# EAGLE design SparkFun_GPS_ZED-F9K_pHat (EAGLE 9.5.1)
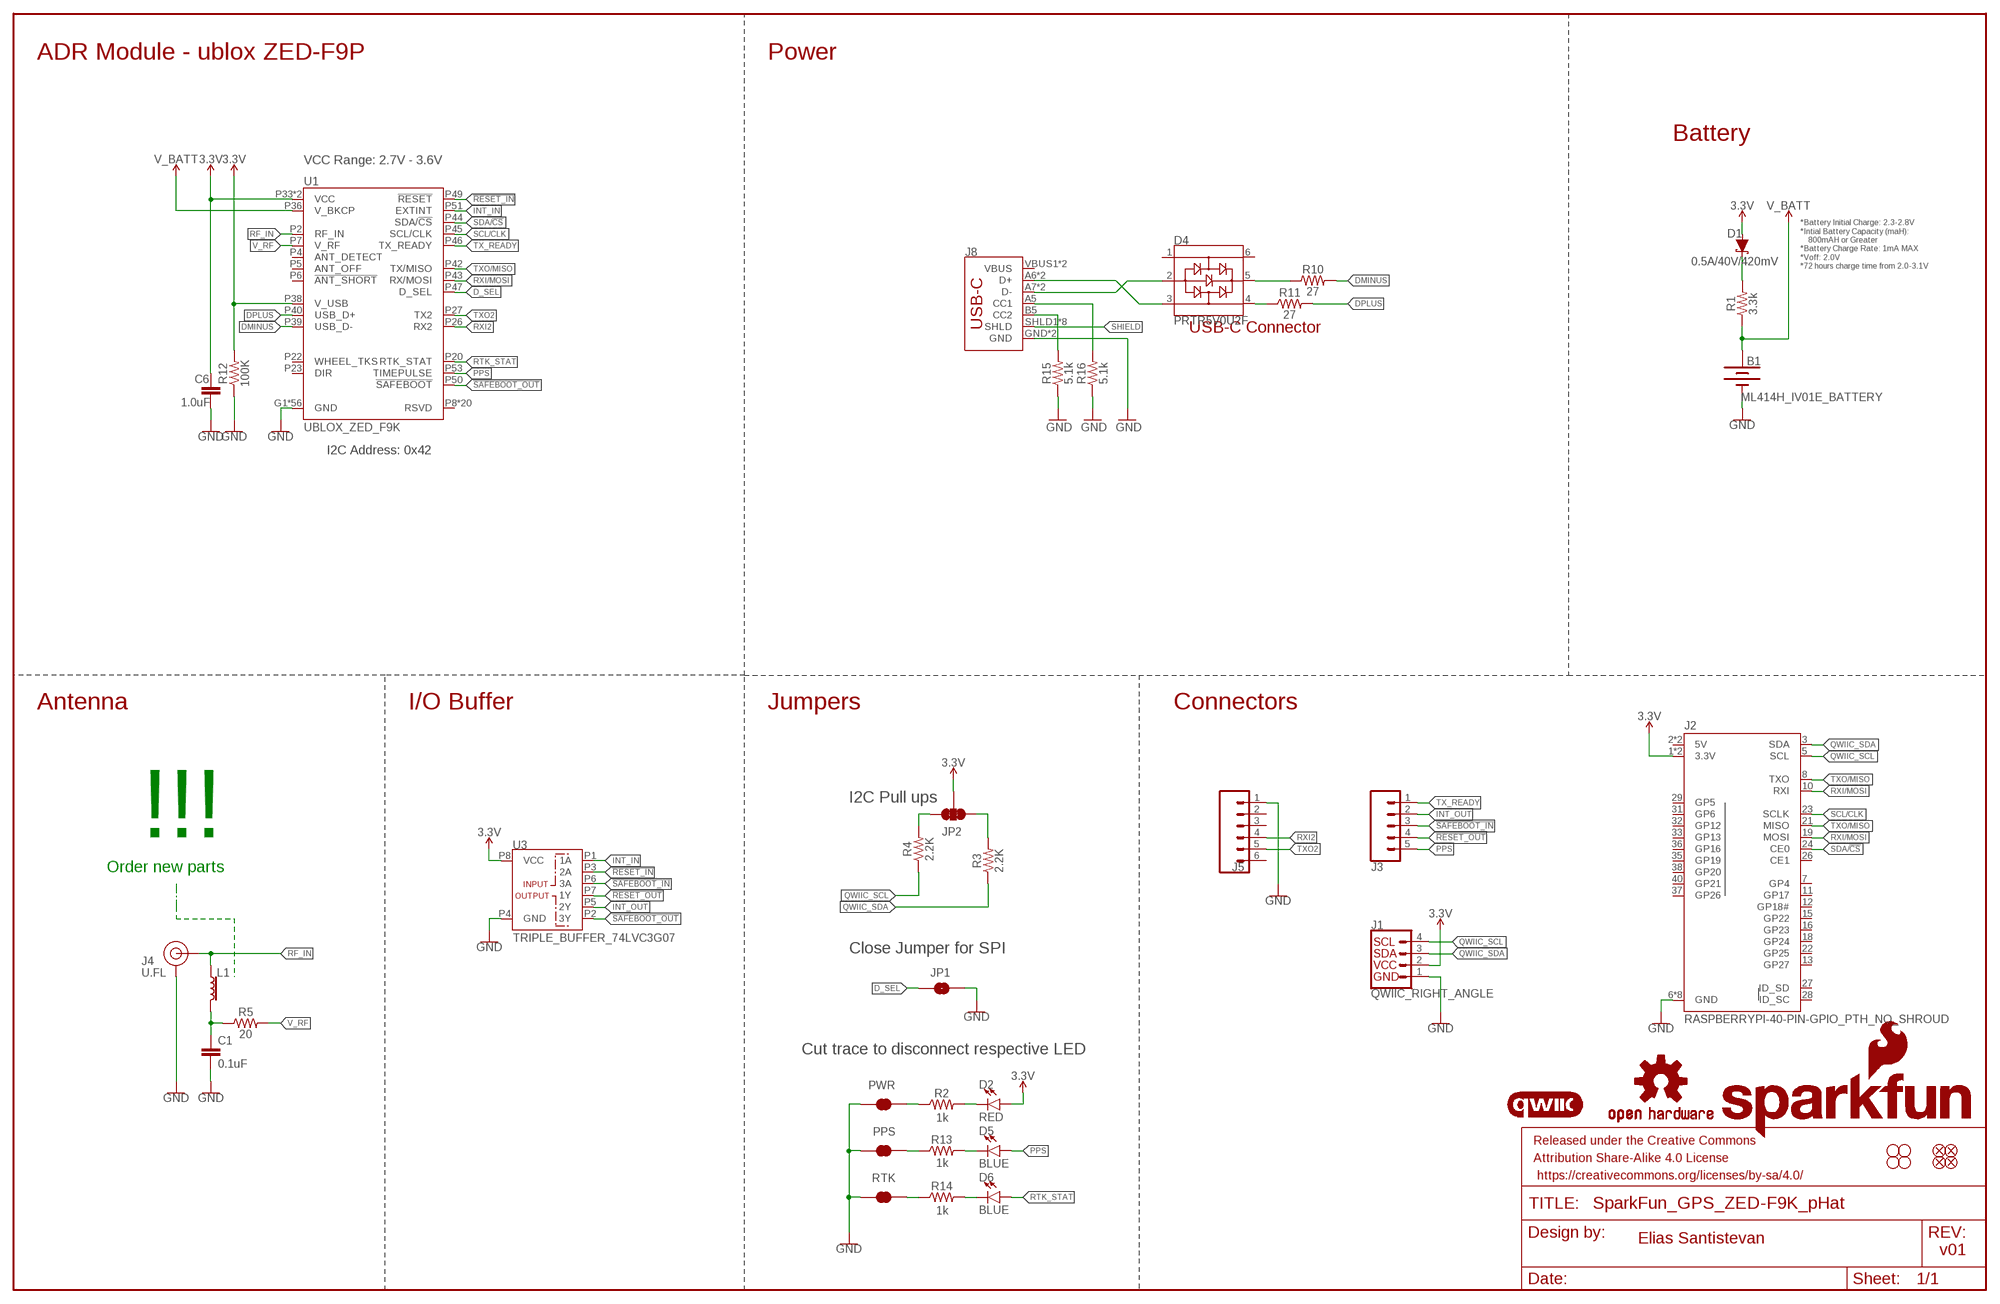
[diagram p0: schematic, sheet 1]

## Parts
B1  ML414H_IV01E_BATTERY  [ML414H_IV01E]
C1  0.1uF  0.1UF-0402-16V-10%  [0402]
C6  1.0uF  1.0UF-0402-16V-10%  [0402]
D1  0.5A/40V/420mV  DIODE-SCHOTTKY-PMEG4005EJ  [SOD-323]
D2  RED  LED-RED0603  [LED-0603]
D4  PRTR5V0U2F  [SOT886]
D5  BLUE  LED-BLUE0603  [LED-0603]
D6  BLUE  LED-BLUE0603  [LED-0603]
FD9  FIDUCIALUFIDUCIAL  [FIDUCIAL-MICRO]
FD10  FIDUCIALUFIDUCIAL  [FIDUCIAL-MICRO]
FD11  FIDUCIALUFIDUCIAL  [FIDUCIAL-MICRO]
FD12  FIDUCIALUFIDUCIAL  [FIDUCIAL-MICRO]
FRAME2  FRAME-LEDGER  [CREATIVE_COMMONS]
H9  STAND-OFFTIGHT  [STAND-OFF-TIGHT]
H10  STAND-OFFTIGHT  [STAND-OFF-TIGHT]
H11  STAND-OFFTIGHT  [STAND-OFF-TIGHT]
H12  STAND-OFFTIGHT  [STAND-OFF-TIGHT]
J1  QWIIC_RIGHT_ANGLE  QWIIC_CONNECTORJS-1MM  [JST04_1MM_RA]
J2  RASPBERRYPI-40-PIN-GPIO_PTH_NO_SHROUD  [2X20]
J3  CONN_05NO_SILK  [1X05_NO_SILK]
J4  U.FL  U.FL2PIN  [U.FL]
J5  CONN_06NO_SILK_NO_POP  [1X06_NO_SILK]
J8  USB_C2-LAYER  [USB-C-16P]
JP1  JUMPER-SMT_2_NO_SILK  [SMT-JUMPER_2_NO_SILK]
JP2  JUMPER-SMT_3_2-NC_TRACE_SILK  [SMT-JUMPER_3_2-NC_TRACE_SILK]
L1  3.9NH  FERRITE_BEAD-120_OHM-0402  [0402]
LOGO1  SFE_LOGO_NAME_FLAME.2_INCH  [SFE_LOGO_NAME_FLAME_.2]
LOGO2  OSHW-LOGOM  [OSHW-LOGO-M]
LOGO3  QWIIC_LOGO_5MM  [QWIIC_5MM]
PPS  JUMPER-SMT_2_NC_TRACE_SILK  [SMT-JUMPER_2_NC_TRACE_SILK]
PWR  JUMPER-SMT_2_NC_TRACE_SILK  [SMT-JUMPER_2_NC_TRACE_SILK]
R1  3.3k  3.3KOHM-0603-1/10W-1%  [0603]
R2  1KOHM-0402-1/16W-1%  [0402]
R3  2.2K  2.2KOHM-0402-1/16W-1%  [0402]
R4  2.2K  2.2KOHM-0402-1/16W-1%  [0402]
R5  20  20OHM-0603-1/10W-1%  [0603]
R10  27  27OHM-0603-1/10W-1%  [0603]
R11  27  27OHM-0603-1/10W-1%  [0603]
R12  100K  100KOHM-0402-1/16W-1%  [0402]
R13  1KOHM-0402-1/16W-1%  [0402]
R14  1KOHM-0402-1/16W-1%  [0402]
R15  5.1k  5.1KOHM-0402-1/16W-1%  [0402]
R16  5.1k  5.1KOHM-0402-1/16W-1%  [0402]
RTK  JUMPER-SMT_2_NC_TRACE_SILK  [SMT-JUMPER_2_NC_TRACE_SILK]
U1  UBLOX_ZED_F9K  [UBLOX_ZED_F9K]
U3  TRIPLE_BUFFER_74LVC3G07  [SOP_8-PIN]

## Nets
3.3V: C6.1 D1.A D2.A J1.2 J2.1(3.3V) J2.17(3.3V) JP2.2 R12.2 U1.P33(VCC) U1.P34(VCC) U1.P38(V_USB) U3.P8(VCC)
!RESET_IN: U1.P49(!RESET!) U3.P3(2A)
!RESET_OUT: J3.4 U3.P7(1Y)
!SAFEBOOT_IN: J3.3 U3.P6(3A)
!SAFEBOOT_OUT: U1.P50(!SAFEBOOT!) U3.P2(3Y)
D_SEL: JP1.1 U1.P47(D_SEL)
DMINUS: R10.2 U1.P39(USB_D-)
DPLUS: R11.2 U1.P40(USB_D+)
GND: B1.- C1.2 C6.2 J1.1 J2.6(GND) J2.9(GND) J2.14(GND) J2.20(GND) J2.25(GND) J2.30(GND) J2.34(GND) J2.39(GND) J4.1(GND) J4.2(GND) J5.1 J8.GND J8.GND2(GND) JP1.2 PPS.1 PWR.1 R12.1 R15.1 R16.1 RTK.1 U1.G1(GND) U1.G2(GND) U1.G3(GND) U1.G4(GND) U1.G5(GND) U1.G6(GND) U1.G7(GND) U1.G8(GND) U1.G9(GND) U1.G10(GND) U1.G11(GND) U1.G12(GND) U1.G13(GND) U1.G14(GND) U1.G15(GND) U1.G16(GND) U1.G17(GND) U1.G18(GND) U1.G19(GND) U1.G20(GND) U1.G21(GND) U1.G22(GND) U1.G23(GND) U1.G24(GND) U1.G25(GND) U1.G26(GND) U1.G27(GND) U1.G28(GND) U1.G29(GND) U1.G30(GND) U1.G31(GND) U1.G32(GND) U1.G33(GND) U1.G34(GND) U1.G35(GND) U1.G36(GND) U1.G37(GND) U1.G38(GND) U1.G39(GND) U1.G40(GND) U1.G41(GND) U1.G42(GND) U1.G43(GND) U1.G44(GND) U1.G45(GND) U1.G46(GND) U1.G47(GND) U1.G48(GND) U1.P1(GND) U1.P3(GND) U1.P12(GND) U1.P14(GND) U1.P32(GND) U1.P37(GND) U1.P41(GND) U1.P48(GND) U3.P4(GND)
INT_IN: U1.P51(EXTINT) U3.P1(1A)
INT_OUT: J3.2 U3.P5(2Y)
N$1: JP2.1 R3.2
N$2: D1.C R1.2
N$3: JP2.3 R4.2
N$4: D2.C R2.2
N$5: C1.1 L1.2 R5.1
N$8: PWR.2 R2.1
N$12: J8.B5(CC2) R15.2
N$16: D4.5 R10.1
N$17: D4.4 R11.1
N$18: J8.A5(CC1) R16.2
N$22: R14.1 RTK.2
N$23: PPS.2 R13.1
N$24: D5.C R13.2
N$25: D6.C R14.2
PPS: D5.A J3.5 U1.P53(TIMEPULSE)
QWIIC_SCL: J1.4 J2.5(SCL) R4.1
QWIIC_SDA: J1.3 J2.3(SDA) R3.1
RF_IN: J4.FEED(SIGNAL) L1.1 U1.P2(RF_IN)
RTK_STAT: D6.A U1.P20(RTK_STAT)
RXI2: J5.4 U1.P26(RX2)
RXI/MOSI: J2.10(RXI) J2.19(MOSI) U1.P43(RX/MOSI)
SCL/CLK: J2.23(SCLK) U1.P45(SCL/CLK)
SDA/!CS: J2.24(CE0) U1.P44(SDA/!CS!)
SHIELD: J8.SHLD1(SHLD) J8.SHLD2(SHLD) J8.SHLD3(SHLD) J8.SHLD4(SHLD) J8.SHLD5(SHLD) J8.SHLD6(SHLD) J8.SHLD7(SHLD) J8.SHLD8(SHLD)
TX_READY: J3.1 U1.P46(TX_READY)
TXO2: J5.5 U1.P27(TX2)
TXO/MISO: J2.8(TXO) J2.21(MISO) U1.P42(TX/MISO)
USB_D+: D4.3 J8.A6(D+) J8.B6(D+)
USB_D-: D4.2 J8.A7(D-) J8.B7(D-)
V_BATT: B1.+ R1.1 U1.P36(V_BKCP)
V_RF: R5.2 U1.P7(V_RF)
Unconnected: D4.1 D4.6 J2.7(GP4) J2.11(GP17) J2.12(GP18#) J2.13(GP27) J2.15(GP22) J2.16(GP23) J2.18(GP24) J2.22(GP25) J2.26(CE1) J2.27(ID_SD) J2.28(ID_SC) J2.29(GP5) J2.31(GP6) J2.32(GP12) J2.33(GP13) J2.35(GP19) J2.36(GP16) J2.37(GP26) J2.38(GP20) J2.40(GP21) J5.2 J5.3 J5.6 J8.VBUS1(VBUS) J8.VBUS2(VBUS) U1.P4(ANT_DETECT) U1.P5(ANT_OFF) U1.P6(!ANT_SHORT!) U1.P8(RSVD) U1.P9(RSVD) U1.P10(RSVD) U1.P11(RSVD) U1.P13(RSVD) U1.P15(RSVD) U1.P16(RSVD) U1.P17(RSVD) U1.P18(RSVD) U1.P19(RSVD) U1.P21(RSVD) U1.P22(WHEEL_TKS) U1.P23(DIR) U1.P24(RSVD) U1.P25(RSVD) U1.P28(RSVD) U1.P29(RSVD) U1.P30(RSVD) U1.P31(RSVD) U1.P35(RSVD) U1.P52(RSVD) U1.P54(RSVD)

## Notes on the sheet
- ADR Module - ublox ZED-F9P | Power
- Battery
- VCC Range: 2.7V - 3.6V
- *Battery Initial Charge: 2.3-2.8V
  *Intial Battery Capacity (maH): 
      800mAH or Greater
  *Battery Charge Rate: 1mA MAX
  *Voff: 2.0V
  *72 hours charge time from 2.0-3.1V
- USB-C Connector
- I2C Address: 0x42
- Antenna | I/O Buffer | Jumpers | Connectors
- I2C Pull ups
- !!!
- Order new parts
- Close Jumper for SPI
- Cut trace to disconnect respective LED
- 1k
- 1k
- 1k
- Elias Santistevan
- v01

## Power pins joined to a net without a drawn wire
5V: J2.2(5V) J2.4(5V)

## Library data of the parts
B1 = SparkFun-Batteries:ML414H_IV01E_BATTERY: SEIKO ML414H-IV01E Reflowable Lithium Battery ML414H is a rechargeable, coin type battery with features such as Pb-free reflowable (Peak temperature: 260 C) and high temperature heat resistance. Battery Characteristics: 3.1V max voltage Voff is 2V 1mAH 3k series resistor with battery 72 hour charge time from 2.0-3.1V 2.3-2.8V initial charge; PROD_ID: BATT-14267
C1 = SparkFun-Capacitors:0.1UF: 0.1µF ceramic capacitors A capacitor is a passive two-terminal electrical component used to store electrical energy temporarily in an electric field.; PROD_ID: CAP-12416
C6 = SparkFun-Capacitors:1.0UF: 1µF ceramic capacitors A capacitor is a passive two-terminal electrical component used to store electrical energy temporarily in an electric field.; PROD_ID: CAP-12417
D1 = SparkFun-DiscreteSemi:DIODE-SCHOTTKY: Schottky diode A Schottky diode is a semiconductor diode which has a low forward voltage drop and a very fast switching action.; PROD_ID: DIO-10955
D2 = SparkFun-LED:LED-RED: Red SMD LED Used in manufacturing of most products at SparkFun Packages: 0603 - SMD 0603 package [Product Link] <http://docs.avagotech.com/docs/AV02-0551EN> 0603 SMART - SMD 0603 SMART package ( more efficient and expensive)[Product Link] <http://www.osram-os.com/Graphics/XPic2/00077099_0.pdf> 1206 - SMD1206 package [Product Link] <https://www.sparkfun.com/datasheets/DevTools/LilyPad/Q150OVS4.pdff> SparkFun Products: Pro Mini 328 -5V <https://www.sparkfun.com/products/821> RedBoard <https://www.sparkfun.com/products/12757> IOIO-OTG <https://www.sparkfun.com/products/13613>; PROD_ID: DIO-00819
D4 = SparkFun-IC-Power:PRTR5V0U2: A small ESD protection device. Most commonly used on USB D+/D- signals to protect large, expensive, or especially sensitive USB enabled devices.; PROD_ID: DIO-14084
D5 D6 = SparkFun-LED:LED-BLUE: Blue SMD LED Used in manufacturing of various products at SparkFun Packages: 0603 - SMD 0603 package [Product Link] <http://www.digikey.com/product-detail/en/SMLE12BC7TT86/511-1589-2-ND/1641808> 1206 - SMD1206 package [Product Link] <http://www.digikey.com/product-detail/en/lite-on-inc/LTST-C150TBKT/160-1643-1-ND/573584> SparkFun Products: ESP8266 Thing-Dev Board <https://www.sparkfun.com/products/13711> RedBoard <https://www.sparkfun.com/products/12757>; PROD_ID: DIO-08575
FD9-FD12 = SparkFun-Aesthetics:FIDUCIAL: Fiducial Alignment Points Point-of-reference for pick-and-place machines and other optical instruments.
FRAME2 = SparkFun-Aesthetics:FRAME-LEDGER: Schematic Frame - Ledger Standard 11x14 US Ledger frame
H9-H12 = SparkFun-Hardware:STAND-OFF: Stand Off Drill holes for mechanically mounting via screws, standoffs, etc. Note: Use the keepout ring to avoid running the screw head into surrounding components. Variant Overviews STAND-OFF - Mechanical footprint for a #4 phillips button head screw. STAND-OFF-TIGHT - Mechanical footprint for a #4 phillips button head screw, Example SparkFun Products Screw - Phillips Head (1/4", 4-40, 10 pack) <https://www.sparkfun.com/products/10453> (PRT-10453) Screw - Phillips Head (1/2", 4-40, 10 pack) <https://www.sparkfun.com/products/10452> (PRT-10452) Screw - Phillips Head (3/4", 4-40, 10 pack) <https://www.sparkfun.com/products/10451> (PRT-10451) Screw - Phillips Head (1", 4-40, 10 pack) <https://www.sparkfun.com/products/10450> (PRT-10450)
J1 = SparkFun-Connectors:QWIIC_CONNECTOR: SparkFun I2C Standard Qwiic Connector An SMD 1mm pitch JST connector makes it easy and quick (get it? Qwiic?) to connect I2C devices to each other. The Qwiic system <http://www.sparkfun.com/qwiic> enables fast and solderless connection between popular platforms and various sensors and actuators. We carry 200mm <https://www.sparkfun.com/products/14204>, 100mm <https://www.sparkfun.com/products/14205>, 50mm <https://www.sparkfun.com/products/14206>, and breadboard friendly <https://www.sparkfun.com/products/14207> Qwiic cables. We also offer 10 pcs strips <https://www.sparkfun.com/products/14323> the SMD connectors.; PROD_ID: CONN-13694
J2 = SparkFun-Connectors:RASPBERRYPI-40-PIN-GPIO: Raspberry Pi GPIO Header 2x20 pin connector, as found on B, B+, A+ models. Both shrouded PTH and SMT versions available. SparkFun Products: GPIO Shrouded Header <https://www.sparkfun.com/products/13054>- PTH SparkFun Pi Wedge (Preassembled) <https://www.sparkfun.com/products/13717>
J3 = SparkFun-Connectors:CONN_05: Multi connection point. Often used as Generic Header-pin footprint for 0.1 inch spaced/style header connections On any of the 0.1 inch spaced packages, you can populate with these: Break Away Headers - Straight <https://www.sparkfun.com/products/116> (PRT-00116) Break Away Male Headers - Right Angle <https://www.sparkfun.com/products/553> (PRT-00553) Female Headers <https://www.sparkfun.com/products/115> (PRT-00115) Break Away Headers - Machine Pin <https://www.sparkfun.com/products/117> (PRT-00117) Break Away Female Headers - Swiss Machine Pin <https://www.sparkfun.com/products/743> (PRT-00743) For SCREWTERMINALS and SPRING TERMINALS visit here: Screw Terimnals on SparkFun.com <https://www.sparkfun.com/search/results?term=Screw+Terminals> (5mm/3.5mm/2.54mm spacing) This device is also useful as a general connection point to wire up your design to another part of your project. Our various solder wires solder well into these plated through hole pads. Hook-Up Wire - Assortment (Stranded, 22 AWG) <https://www.sparkfun.com/products/11375> (PRT-11375) Hook-Up Wire - Assortment (Solid Core, 22 AWG) <https://www.sparkfun.com/products/11367> (PRT-11367) View the entire wire category on our website here <https://www.sparkfun.com/categories/141> Special notes: Molex polarized connector foot print use with SKU : PRT-08231 with associated crimp pins and housings. 1MM SMD Version SKU: PRT-10208
J4 = SparkFun-Connectors:U.FL2PIN: SMD Antenna Connector - U.FL 2mm height, 3.0mm x 3.0mm receptacle size. SparkFun Products: SparkFun WiFi Shield - ESP8266 <https://www.sparkfun.com/products/13287> SparkFun ESP8266 Thing <https://www.sparkfun.com/products/13231> SparkFun MiniGen - Pro Mini Signal Generator Shield <https://www.sparkfun.com/products/11420>; PROD_ID: CONN-09193; SF_ID: WRL-09144
J5 = SparkFun-Connectors:CONN_06: Multi connection point. Often used as Generic Header-pin footprint for 0.1 inch spaced/style header connections On any of the 0.1 inch spaced packages, you can populate with these: Break Away Headers - Straight <https://www.sparkfun.com/products/116> (PRT-00116) Break Away Male Headers - Right Angle <https://www.sparkfun.com/products/553> (PRT-00553) Female Headers <https://www.sparkfun.com/products/115> (PRT-00115) Break Away Headers - Machine Pin <https://www.sparkfun.com/products/117> (PRT-00117) Break Away Female Headers - Swiss Machine Pin <https://www.sparkfun.com/products/743> (PRT-00743) Arduino Stackable Header - 6 Pin <https://www.sparkfun.com/products/9280> (PRT-09280) For SCREWTERMINALS and SPRING TERMINALS visit here: Screw Terimnals on SparkFun.com <https://www.sparkfun.com/search/results?term=Screw+Terminals> (5mm/3.5mm/2.54mm spacing) This device is also useful as a general connection point to wire up your design to another part of your project. Our various solder wires solder well into these plated through hole pads. Hook-Up Wire - Assortment (Stranded, 22 AWG) <https://www.sparkfun.com/products/11375> (PRT-11375) Hook-Up Wire - Assortment (Solid Core, 22 AWG) <https://www.sparkfun.com/products/11367> (PRT-11367) View the entire wire category on our website here <https://www.sparkfun.com/categories/141>
J8 = SparkFun-Connectors:USB_C: USB Type C 16Pin Connector Super Speed pins not available on the 16-pin purely SMD connector so this part is best for USB 2.0 implementations. D1 and D2 are tied together enabling D+/- no matter which way the cable is plugged into the connector. The two channel configuration pins (CC1/2) are exposed. These are normally connected to ground via 5.1k resistors but can be reconfigured for high current/high power applications.; PROD_ID: CONN-14122
JP1 = SparkFun-Jumpers:JUMPER-SMT_2_NO: Normally open jumper This jumper has two pads in close proximity to each other. Apply solder to close the connection. Round pads are easier to solder for beginners, but are a lot larger. SparkFun Product that uses the round pads: SparkFun EL Sequencer <https://www.sparkfun.com/products/12781>
JP2 = SparkFun-Jumpers:JUMPER-SMT_3_2-NC_TRACE: Normally closed trace jumper (2 of 2 connections) This jumper has a trace between all three pads so they are normally closed (NC). Use a razor knife to open the connection(s). For best results follow the IPC guidelines for cutting traces: Cutout at least 0.063 mm (0.005 in). Remove all loose material to clean up the cut area. Seal the cut with an approved epoxy. Reapply solder to reclose the connection(s).
L1 = SparkFun-Coils:FERRITE_BEAD-120_OHM: Ferrite Bead (blocks, cores, rings, chokes, etc.) Inductor with layers of ferrite used to suppress high frequencies. Often used to isolate high frequency noise.; MFG_PART: BLM15HB121SN1D; PROD_ID: NDUC-14206
LOGO1 = SparkFun-Aesthetics:SFE_LOGO_NAME_FLAME: SparkFun Font Logo w/ Flame This is the SparkFun full logo. The logo on the schematic will always be the same size; the package variant is the height of the flame part of the logo. Default layer for the logo on the board is tSilk.
LOGO2 = SparkFun-Aesthetics:OSHW-LOGO: Open-Source Hardware (OSHW) Logo This logo indicates the piece of hardware it is found on incorporates a OSHW license and/or adheres to the definition of open source hardware found here: http://freedomdefined.org/OSHW
LOGO3 = SparkFun-Aesthetics:QWIIC_LOGO: Qwiic Logos for placement on schematic and PCB. The 5.5mm silk logo is best for placing next to Qwiic connector.
PPS PWR RTK = SparkFun-Jumpers:JUMPER-SMT_2_NC_TRACE: Normally closed trace jumper This jumper has a trace between two pads so it's normally closed (NC). Use a razor knife to open the connection. For best results follow the IPC guidelines for cutting traces: Cutout at least 0.063 mm (0.005 in). Remove all loose material to clean up the cut area. Seal the cut with an approved epoxy. Reapply solder to reclose the connection.
R1 = SparkFun-Resistors:3.3KOHM: 3.3kΩ resistor A resistor is a passive two-terminal electrical component that implements electrical resistance as a circuit element. Resistors act to reduce current flow, and, at the same time, act to lower voltage levels within circuits. - Wikipedia; PROD_ID: RES-07851
R2 R13 R14 = SparkFun-Resistors:1KOHM: 1kΩ resistor A resistor is a passive two-terminal electrical component that implements electrical resistance as a circuit element. Resistors act to reduce current flow, and, at the same time, act to lower voltage levels within circuits. - Wikipedia; PROD_ID: RES-14342
R3 R4 = SparkFun-Resistors:2.2KOHM: 2.2kΩ resistor A resistor is a passive two-terminal electrical component that implements electrical resistance as a circuit element. Resistors act to reduce current flow, and, at the same time, act to lower voltage levels within circuits. - Wikipedia; PROD_ID: RES-14341
R5 = SparkFun-Resistors:20OHM: RES-07862; PROD_ID: RES-07862
R10 R11 = SparkFun-Resistors:27OHM: 27Ω resistor A resistor is a passive two-terminal electrical component that implements electrical resistance as a circuit element. Resistors act to reduce current flow, and, at the same time, act to lower voltage levels within circuits. - Wikipedia; PROD_ID: RES-09334
R12 = SparkFun-Resistors:100KOHM: 100kΩ resistor A resistor is a passive two-terminal electrical component that implements electrical resistance as a circuit element. Resistors act to reduce current flow, and, at the same time, act to lower voltage levels within circuits. - Wikipedia; PROD_ID: RES-13495
R15 R16 = SparkFun-Resistors:5.1KOHM; PROD_ID: RES-14340
U1 = classified:UBLOX_ZED_F9K: u-blox ZED-F9K ADR GPS Unit with Real Time Kinematics (RTK) and internal IMU = Automotive Dead Reckoning; PROD_ID: IC-14677
U3 = classified:TRIPLE_BUFFER_74LVC3G07: Triple Buffer with Open Drain Output - 74LVC3G07 The 74LVC3G07 provides three non-inverting buffers. The output of the device is an open-drain and can be connected to other open-drain outputs to implement active-LOW wired-OR or active-HIGH wired-AND functions. Input can be driven from either 3.3 V or 5 V devices. This feature allows the use of this device in a mixed 3.3 V and 5 V environment. Schmitt trigger action at all inputs makes the circuit tolerant for slower input rise and fall time. This device is fully specified for partial power-down applications using IOFF. The IOFF circuitry disables the output, preventing the damaging backflow current through the device when it is powered down

## Net classes
1 Antenna: width 1 mm, clearance 0.3 mm

## Board
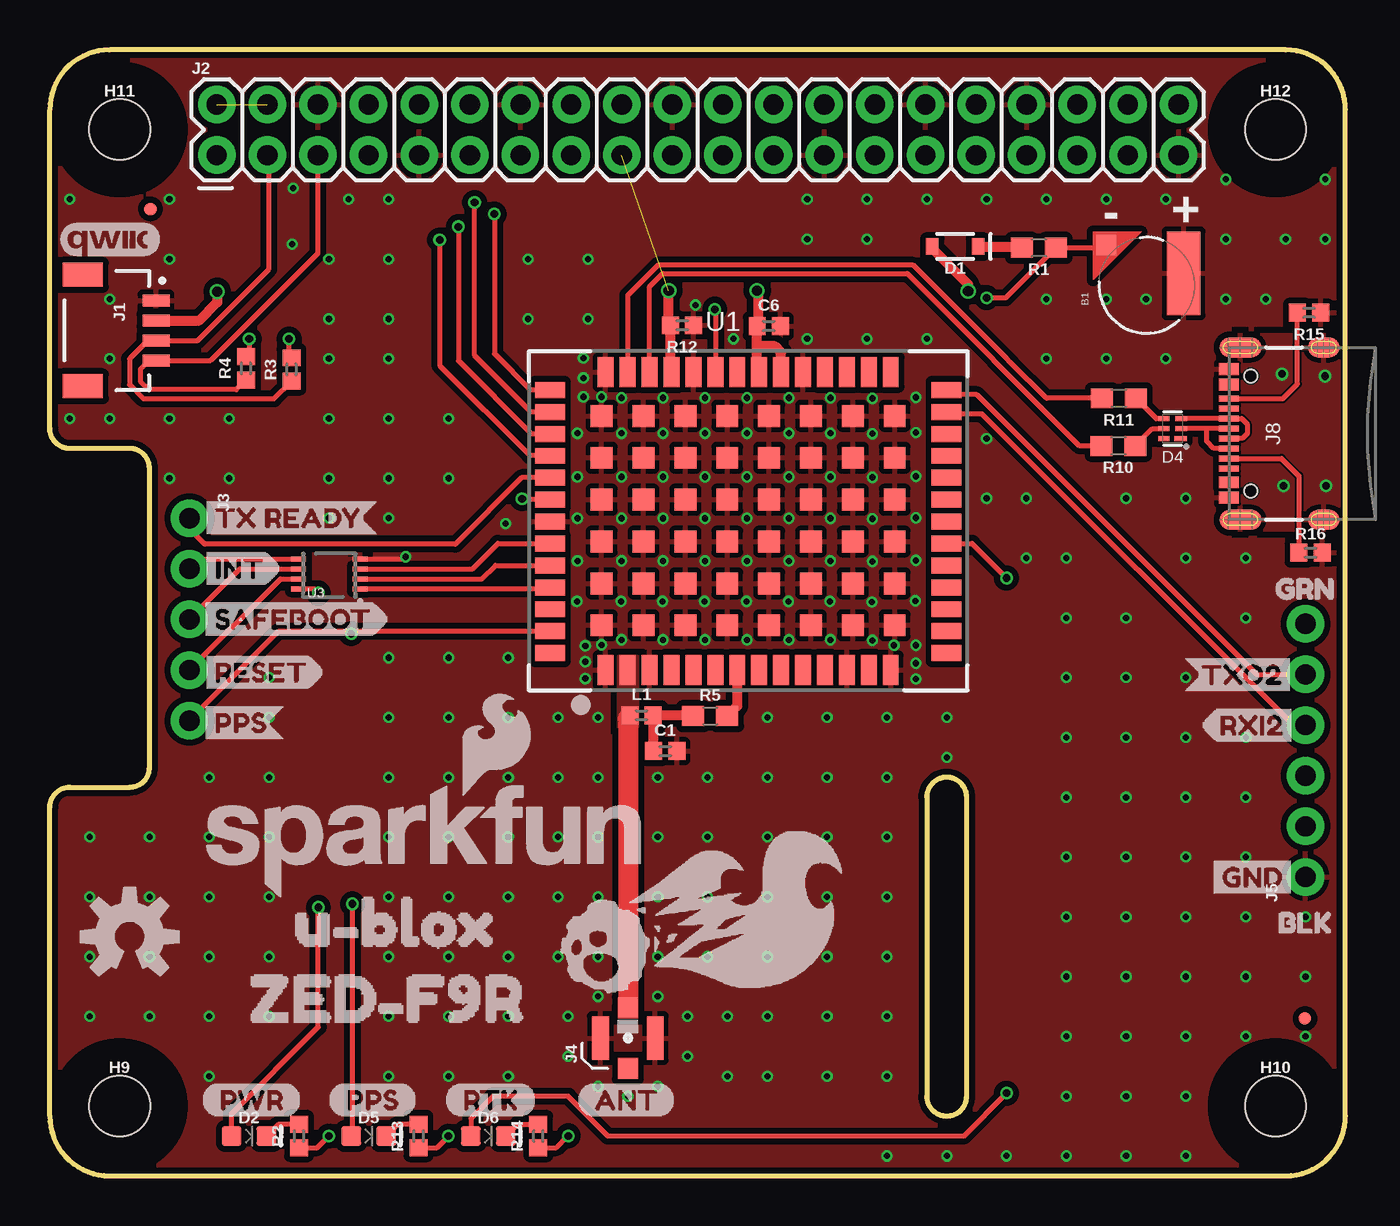
[diagram p1: board, top side]
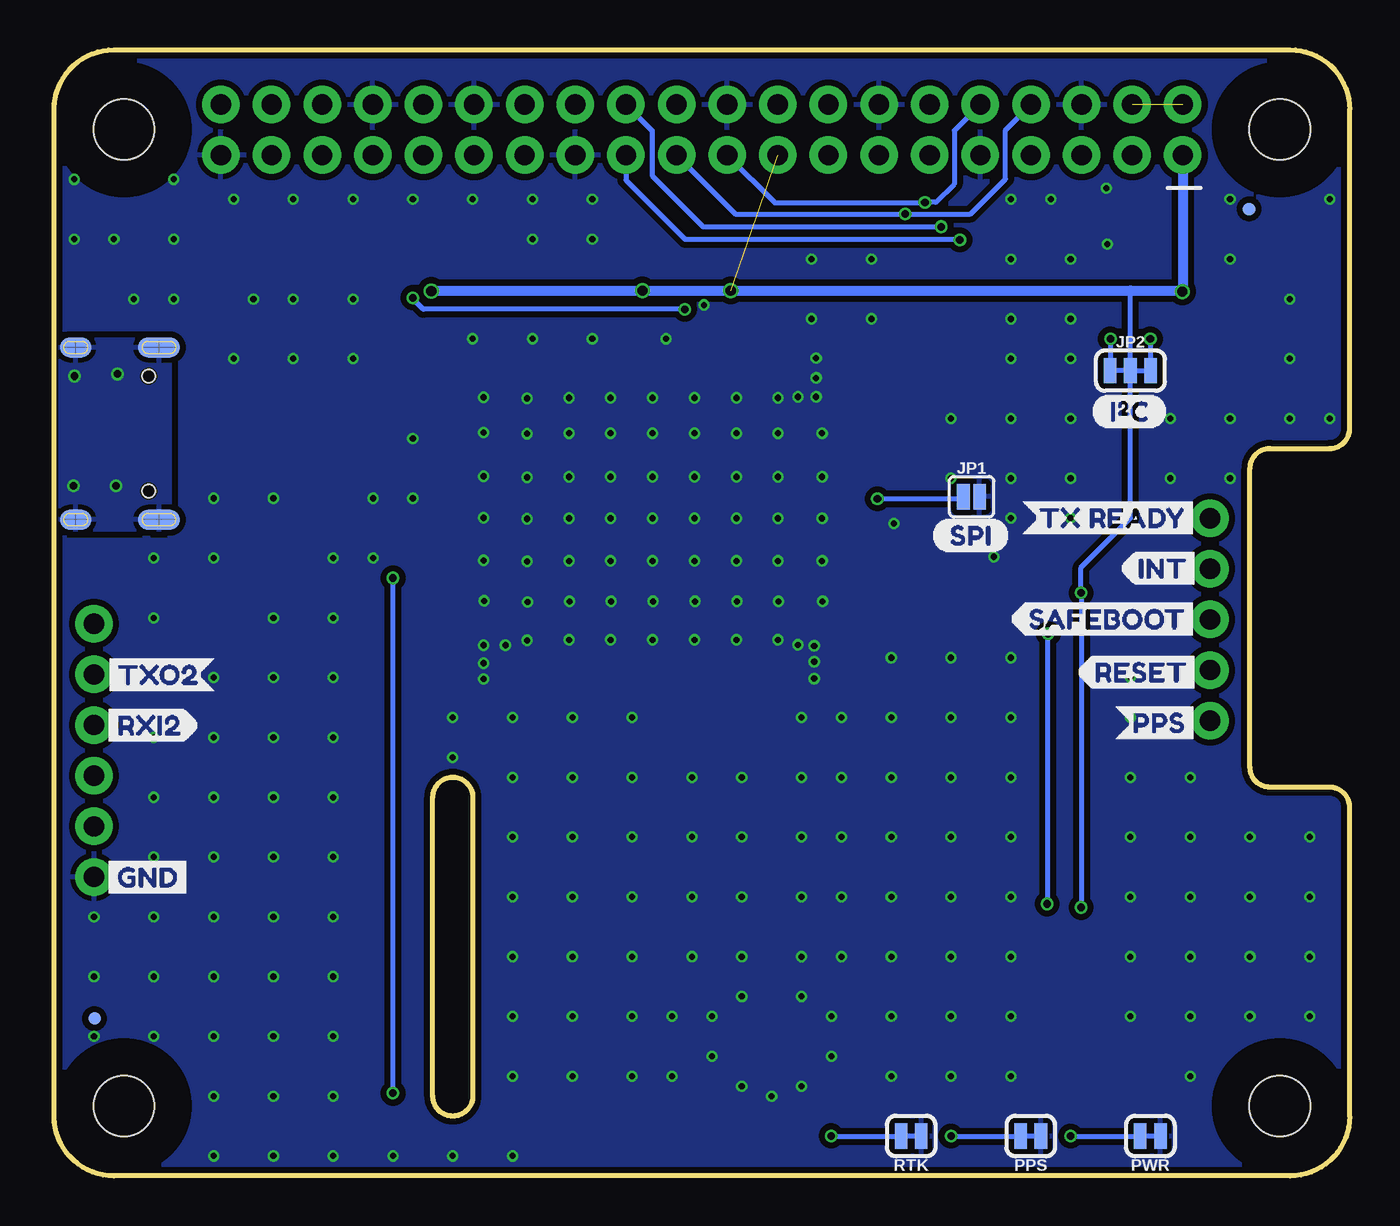
[diagram p2: board, bottom side, seen from below]

Size 65 x 56.5 mm. Coordinates in mm from the lower left corner, seen from the top.
Outline: 3,0 62,0 arc90 65,3 65,53.5 arc90 62,56.5 3,56.5 arc90 0,53.5 0,37.5 arc90 1,36.5 4,36.5 arc-90 5,35.5 5,20.5 arc-90 4,19.5 1,19.5 arc90 0,18.5 0,3 arc90 3,0
Outline: 45,3 arc90 46,4 46,19 arc90 45,20 arc90 44,19 44,4 arc90 45,3
Copper layers (1*16): Top 0.035mm / dielectric 1.5mm / Bottom 0.035mm
Design rules "SparkFun-2-layer-FAB-LIMIT": minimum track width 4mil, minimum drill 6mil, track to track 4mil, track to pad 4mil, pad to pad 4mil, via to via 4mil, smd to smd 4mil, copper to edge 4mil, drill to drill 4mil, minimum pad ring 5mil, minimum via ring 5mil, stop-mask expansion 4mil, vias tented up to drill 25mil, thermal gap 10mil
tRestrict: area 58.4,0.4 to 64.6,6.6; area 0.4,0.4 to 6.6,6.6; area 0.4,49.4 to 6.6,55.6; area 58.4,49.4 to 64.6,55.6
bRestrict: area 0.4,0.4 to 6.6,6.6; area 0.4,49.4 to 6.6,55.6; area 58.4,0.4 to 64.6,6.6; area 58.4,49.4 to 64.6,55.6

### Footprints (pad centres in the part's own frame; a part is rotated, then mirrored left to right if it is on the bottom)
ML414H_IV01E = smd 1 x 1: + 2.022,2.032 | smd 4.2 x 1.7: - 0.6,-1.85
0402 = smd 0.85 x 0.9: 1 -0.58,0; 2 0.58,0
SOD-323 = smd 0.63 x 0.83: A 1.15,0; C -1.15,0
LED-0603 = smd 1 x 1: A -0.877,0; C 0.877,0
SOT886 = smd 0.61 x 0.25: 1 -0.405,0.5 | smd 0.56 x 0.25: 2 -0.43,0; 3 -0.43,-0.5; 4 0.43,-0.5; 5 0.43,0; 6 0.43,0.5
FIDUCIAL-MICRO = smd 0.635 x 0.635: 1 0,0
STAND-OFF-TIGHT = hole 3.048: 0,0
JST04_1MM_RA = smd 0.6 x 1.35: 1 -1.5,0; 2 -0.5,0; 3 0.5,0; 4 1.5,0 | smd 1.2 x 2: NC1 2.8,-3.675; NC2 -2.8,-3.675
2X20 = drill 1.016 pad 1.88: 1 0,0; 2 0,2.54; 3 2.54,0; 4 2.54,2.54; 5 5.08,0; 6 5.08,2.54; 7 7.62,0; 8 7.62,2.54; 9 10.16,0; 10 10.16,2.54; 11 12.7,0; 12 12.7,2.54; 13 15.24,0; 14 15.24,2.54; 15 17.78,0; 16 17.78,2.54; 17 20.32,0; 18 20.32,2.54; 19 22.86,0; 20 22.86,2.54; 21 25.4,0; 22 25.4,2.54; 23 27.94,0; 24 27.94,2.54; 25 30.48,0; 26 30.48,2.54; 27 33.02,0; 28 33.02,2.54; 29 35.56,0; 30 35.56,2.54; 31 38.1,0; 32 38.1,2.54; 33 40.64,0; 34 40.64,2.54; 35 43.18,0; 36 43.18,2.54; 37 45.72,0; 38 45.72,2.54; 39 48.26,0; 40 48.26,2.54
1X05_NO_SILK = drill 1.016 pad 1.88: 1 0,0; 2 2.54,0; 3 5.08,0; 4 7.62,0; 5 10.16,0
U.FL = smd 2.2 x 0.85: 1 0,1.375; 2 0,-1.375 | smd 1.05 x 1: FEED 1.525,0; NC -1.525,0
1X06_NO_SILK = drill 1.016 pad 1.88: 1 0,0; 2 2.54,0; 3 5.08,0; 4 7.62,0; 5 10.16,0; 6 12.7,0
USB-C-16P = smd 0.3 x 1: A5 -1.25,-0.34; A6 -0.25,-0.34; A7 0.25,-0.34; A8 1.25,-0.34; B5 1.75,-0.34; B6 0.75,-0.34; B7 -0.75,-0.34; B8 -1.75,-0.34 | smd 0.6 x 1: GND -3.225,-0.34; GND2 3.225,-0.34; VBUS1 -2.45,-0.34; VBUS2 2.45,-0.34 | smd 1 x 2.1: SHLD1 -4.32,-0.915; SHLD2 4.32,-0.915 | smd 1 x 2.1 bottom: SHLD3 -4.32,-0.915; SHLD4 4.32,-0.915 | smd 1 x 1.6: SHLD5 -4.32,-5.095; SHLD8 4.32,-5.095 | smd 1 x 1.6 bottom: SHLD6 -4.32,-5.095; SHLD7 4.32,-5.095 | hole 0.65: -2.89,-1.445; 2.89,-1.445
SMT-JUMPER_2_NO_SILK = smd 0.635 x 1.27: 1 -0.406,0; 2 0.406,0
SMT-JUMPER_3_2-NC_TRACE_SILK = smd 0.635 x 1.27: 1 -1.016,0; 2 0,0; 3 1.016,0
SMT-JUMPER_2_NC_TRACE_SILK = smd 0.635 x 1.27: 1 -0.508,0; 2 0.508,0
0603 = smd 1.1 x 1: 1 -0.85,0; 2 0.85,0
UBLOX_ZED_F9K = smd 1.1 x 1.1: G1 -7.312,-5.37; G2 -5.212,-5.37; G3 -3.112,-5.37; G4 -1.012,-5.37; G5 1.088,-5.37; G6 3.188,-5.37; G7 5.288,-5.37; G8 7.388,-5.37; G9 7.388,-3.27; G10 5.288,-3.27; G11 3.188,-3.27; G12 1.088,-3.27; G13 -1.012,-3.27; G14 -3.112,-3.27; G15 -5.212,-3.27; G16 -7.312,-3.27; G17 -7.312,-1.17; G18 -5.212,-1.17; G19 -3.112,-1.17; G20 -1.012,-1.17; G21 1.088,-1.17; G22 3.188,-1.17; G23 5.288,-1.17; G24 7.388,-1.17; G25 7.388,0.93; G26 5.288,0.93; G27 3.188,0.93; G28 1.088,0.93; G29 -1.012,0.93; G30 -3.112,0.93; G31 -5.212,0.93; G32 -7.312,0.93; G33 -7.312,3.03; G34 -5.212,3.03; G35 -3.112,3.03; G36 -1.012,3.03; G37 1.088,3.03; G38 3.188,3.03; G39 5.288,3.03; G40 7.388,3.03; G41 7.388,5.13; G42 5.288,5.13; G43 3.188,5.13; G44 1.088,5.13; G45 -1.012,5.13; G46 -3.112,5.13; G47 -5.212,5.13; G48 -7.312,5.13 | smd 0.8 x 1.5: P1 -7.112,-7.62; P2 -6.012,-7.62; P3 -4.912,-7.62; P4 -3.812,-7.62; P5 -2.712,-7.62; P6 -1.612,-7.62; P7 -0.512,-7.62; P8 0.588,-7.62; P9 1.688,-7.62; P10 2.788,-7.62; P11 3.888,-7.62; P12 4.988,-7.62; P13 6.088,-7.62; P14 7.188,-7.62; P28 7.188,7.33; P29 6.088,7.33; P30 4.988,7.33; P31 3.888,7.33; P32 2.788,7.33; P33 1.688,7.33; P34 0.588,7.33; P35 -0.512,7.33; P36 -1.612,7.33; P37 -2.712,7.33; P38 -3.812,7.33; P39 -4.912,7.33; P40 -6.012,7.33; P41 -7.112,7.33 | smd 1.5 x 0.8: P15 9.988,-6.77; P16 9.988,-5.67; P17 9.988,-4.57; P18 9.988,-3.47; P19 9.988,-2.37; P20 9.988,-1.27; P21 9.988,-0.17; P22 9.988,0.93; P23 9.988,2.03; P24 9.988,3.13; P25 9.988,4.23; P26 9.988,5.33; P27 9.988,6.43; P42 -9.912,6.43; P43 -9.912,5.33; P44 -9.912,4.23; P45 -9.912,3.13; P46 -9.912,2.03; P47 -9.912,0.93; P48 -9.912,-0.17; P49 -9.912,-1.27; P50 -9.912,-2.37; P51 -9.912,-3.47; P52 -9.912,-4.57; P53 -9.912,-5.67; P54 -9.912,-6.77
SOP_8-PIN = smd 0.75 x 0.25: P1 -1.571,0.748; P2 -1.571,0.248; P3 -1.571,-0.252; P4 -1.571,-0.752; P5 1.529,-0.752; P6 1.529,-0.252; P7 1.529,0.248; P8 1.529,0.748

### Placement (x,y rotation side)
B1  55.03,44.69 90 top
C1  30.88,21.31 0 top
C6  36.07,42.63 0 top
D1  45.42,46.63 180 top
D2  10,2 0 top
D4  56.33,37.49 180 top
D5  16,2 0 top
D6  22,2 0 top
FD9  62.97,7.9 90 top
FD10  62.97,7.9 270 bottom
FD11  5.05,48.51 0 top
FD12  5.05,48.51 0 bottom
FRAME2  1.78,-16.26 0 top  (outside the outline)
H9  3.5,3.5 0 top
H10  61.5,3.5 0 top
H11  3.5,52.5 0 top
H12  61.5,52.5 0 top
J1  5.33,42.42 270 top
J2  8.37,51.22 0 top
J3  7,33 270 top
J4  29,6.91 90 top
J5  63,15 90 top
J8  58.82,37.25 90 top
JP1  18.97,34.08 0 bottom
JP2  11,40.41 0 bottom
L1  29.69,23.11 0 top
LOGO1  18.84,16.81 0 top
LOGO2  4,12 0 top
LOGO3  3,47 0 top
PPS  16,2 180 bottom
PWR  10,2 180 bottom
R1  49.62,46.57 180 top
R2  12.5,2 90 top
R3  12.13,40.47 90 top
R4  9.84,40.52 90 top
R5  33.13,23.07 0 top
R10  53.61,36.63 180 top
R11  53.63,39.01 180 top
R12  31.72,42.68 180 top
R13  18.5,2 90 top
R14  24.5,2 90 top
R15  63.18,43.3 180 top
R16  63.25,31.27 180 top
RTK  22,2 180 bottom
U1  35,33 0 top
U3  14,30.2 180 top
U$1  [INT1]  7.35,30.48 0 top
U$2  [PPS4]  7.35,22.73 0 top
U$3  [PPS6]  13.97,3.81 0 top
U$4  [PWR7]  7.62,3.81 0 top
U$5  [RTK5]  19.81,3.81 0 top
U$6  [RXI28]  57.78,22.61 0 top
U$7  [SAFEBOOT2]  7.35,27.94 0 top
U$8  [RESET0]  7.35,25.27 0 top
U$9  [TX_READY0]  7.35,33.02 0 top
U$10  [TXO21]  56.85,25.15 0 top
U$11  [INT2]  11.56,30.48 0 bottom
U$12  [PPS1]  11.81,22.73 0 bottom
U$13  [RESET4]  13.72,25.27 0 bottom
U$14  [RXI26]  62.74,22.61 0 bottom
U$15  [SAFEBOOT3]  17.02,27.94 0 bottom
U$16  [TXO25]  62.74,25.15 0 bottom
U$17  [TX_READY0]  16.51,33.02 0 bottom
U$18  [GND-04]  57.91,14.99 0 top
U$19  [GND-04]  62.74,14.99 0 bottom
U$20  [I_SUPER2_C-()-04]  12.95,38.35 0 bottom
U$21  [ANT1]  26.42,3.81 0 top
U$22  [BLK3]  60.71,12.7 0 top
U$23  [GRN2]  60.58,29.46 0 top
U$24  [SPI0]  20.95,32.13 0 bottom
U$25  [U#BLOX1]  10.16,12.7 0 top
U$26  [ZED#F9R0]  8,8.89 0 top
U$27  [NEO_GPS_BOARD_SILK_FINAL#03#JPG]  32.77,13.21 0 top

### Tracks (layer width: path | path; a pad name or v marks a point on that pad's centre or on a via)
3.3V  (via drill 0.38, 0.51)  (1 unrouted)
  Top 0.254: v13.48,29.25 13.28,29.45 U3.P8 | D2.A 9.12,3.12 13.47,7.47 v13.47,13.47
  Top 0.508: J2.1 8.45,51.14 | v8.4,44.37 8.4,43.83 7.49,42.92 J1.2 | U1.P38 31.14,40.37 R12.2 31.05,42.77 v31.05,44.42 | U1.P34 35.49,40.43 35.49,41.63 | 35.49,41.63 C6.1 35.54,42.69 35.54,44.37 v35.48,44.42 | U1.P33 36.69,41.31 36.37,41.63 35.49,41.63 | v46.08,44.4 46.08,44.73 44.27,46.53 D1.A
  Bottom 0.254: 11,44.42 JP2.2 11,33 13.48,30.52 v13.48,29.25 v13.47,29.25 v13.47,13.47
  Bottom 0.508: v46.08,44.4 46.05,44.42 v35.48,44.42 v31.05,44.42 11,44.42 8.47,44.42 8.46,44.44 | 8.46,44.44 v8.4,44.37 | J2.1 8.37,44.53 8.46,44.44
5V  (1 unrouted)
!RESET_IN
  Top 0.254: U3.P3 21.2,30.45 22.48,31.73 U1.P49
!RESET_OUT
  Top 0.254: J3.4 11.57,29.95 U3.P7
!SAFEBOOT_IN
  Top 0.254: J3.3 9.53,30.45 U3.P6
!SAFEBOOT_OUT
  Top 0.254: U3.P2 21.67,29.95 22.35,30.63 U1.P50
D_SEL  (via drill 0.38)
  Top 0.254: U1.P47 23.74,33.93 v23.69,33.98
  Bottom 0.254: v23.69,33.98 19.49,33.98 JP1.1
DMINUS
  Top 0.254: R10.2 51.67,36.63 43.02,45.28 30.75,45.28 30.09,44.62 U1.P39
DPLUS
  Top 0.254: U1.P40 28.99,44.17 30.51,45.7 43.32,45.7 48.01,41.01 48.2,40.82 50,39.01 R11.2
GND  (via drill 0.3)
  Top 0.254: U3.P4 17.74,30.95 v17.86,31.06
  other vias: 26.77,39.09 28.68,39.04 30.76,39.04 32.87,39.04 34.98,39.04 37.08,39.04 39.17,39.04 41.27,39.01 43.46,39.07 26.47,37.26 28.68,37.26 30.76,37.26 32.87,37.26 34.98,37.26 37.08,37.26 39.17,37.26 41.27,37.24 43.46,37.29 26.47,35.08 28.68,35.08 30.76,35.08 32.87,35.08 34.98,35.08 37.08,35.08 39.17,35.08 41.27,35.05 43.46,35.1 26.47,32.99 28.68,32.99 30.76,32.99 32.87,32.99 34.98,32.99 37.08,32.99 39.17,32.99 41.27,32.97 43.46,33.02 26.47,30.86 28.68,30.86 30.76,30.86 32.87,30.86 34.98,30.86 37.08,30.86 39.17,30.86 41.27,30.84 43.46,30.89 26.44,28.83 28.65,28.83 30.73,28.83 32.84,28.83 34.95,28.83 37.06,28.83 39.14,28.83 41.25,28.8 43.43,28.85 26.87,26.6 28.68,26.9 30.76,26.9 32.87,26.9 34.98,26.9 37.08,26.9 39.17,26.9 41.27,26.87 43.46,26.62 22.86,32.74 51,25 51,28 54,28 54,25 51,22 54,22 51,19 54,19 51,16 54,16 51,13 54,13 51,10 54,10 51,7 54,7 51,4 54,1 51,1 54,4 57,25 57,22 57,19 57,16 57,13 57,10 57,7 57,1 57,4 60,22 60,19 60,16 60,13 60,10 60,7 33,20 36,20 33,17 36,17 33,14 36,14 33,11 36,11 34,8 36,8 34,5 36,5 39,20 39,17 39,14 39,11 39,8 39,5 42,20 42,17 42,14 42,11 42,8 42,5 17,20 20,20 17,17 20,17 17,14 20,14 17,11 20,11 17,8 20,8 17,5 20,5 23,20 23,17 23,14 23,11 23,8 23,5 25.5,20 25.5,17 25.5,14 25.5,11 26,8 27.5,4.5 36,23 39,23 42,23 45,23 45,21 45,1 42,1 48,1 29,4 27.5,20 27.5,17 27.5,14 27.5,11 27.5,9 26,6 32,6 32,8 30.5,9 30.5,11 30.5,14 30.5,17 30.5,20 30.5,4.5 27.5,23 17,23 20,23 23,23 25.5,23 17,26 20,26 23,26 51,31 49,31 47,34 49,34 47,37 8,20 11,20 8,17 11,17 8,14 11,14 8,11 11,11 8,8 11,8 8,5 2,17 5,17 2,14 5,14 2,11 5,11 2,8 5,8 14,38 17,38 14,35 17,35 14,41 17,41 3,38 6,38 14,33 17,33 14,43 17,43 20,38 20,35 9,38 9,35 6,35 14,46 17,46 17,49 15,49 24,43 27,43 27,46 24,46 38,42 41,42 44,42 38,47 41,47 50,41 53,41 50,44 53,44 55,44 56,41 59,44 61,44 59,47 62,47 59,50 38,49 41,49 44,49 47,49 50,49 53,49 56,49 64,47 64,50 60,28 60,31 57,31 57,34 54,34 11,23 11,25 12.15,46.75 12.2,49.55 63,13 63,10 63,7 1,38 1,49 6,49 6,46 3,44 3,41 32.4,43.7 34.3,42 43.46,25.72 43.46,24.92 26.87,25.8 26.87,24.95 26.77,40.04 26.77,41.04 27.68,39.09 27.68,26.65 42.36,26.62
  pour Top (isolate 0.305, rank 3): 62,0 arc90 65,3 65,53.5 arc90 62,56.5 3,56.5 arc90 0,53.5 0,3 arc90 3,0
  pour Bottom (isolate 0.305, rank 3): 3,0 arc-90 0,3 0,53.5 arc-90 3,56.5 62,56.5 arc-90 65,53.5 65,3 arc-90 62,0
INT_IN
  Top 0.254: U1.P51 25.01,29.45 U3.P1
INT_OUT
  Top 0.254: J3.2 7.49,30.95 U3.P5
N$1  (via drill 0.38)
  Top 0.254: R3.2 12,41.17 v12,42
  Bottom 0.254: v12,42 12.02,41.98 JP2.1
N$2
  Top 0.508: D1.C 48.7,46.63 R1.2
N$3  (via drill 0.38)
  Top 0.254: v10,42 10,41.25 R4.2
  Bottom 0.254: JP2.3 9.98,41.98 v10,42
N$4
  Top 0.254: R2.2 11.46,2.58 D2.C
N$5
  Top 0.508: R5.1 32.24,23.11 L1.2 30.3,23.09 C1.1
N$8  (via drill 0.38)
  Top 0.254: R2.1 13.42,1.42 v14,2
  Bottom 0.254: v14,2 PWR.2
N$12
  Top 0.254: J8.B5 61.86,39 62.59,39.73 R15.2
N$16
  Top 0.254: R10.1 55.32,37.49 D4.5
N$17
  Top 0.254: D4.4 55.51,37.99 R11.1
N$18
  Top 0.254: J8.A5 61.79,36 62.67,35.12 R16.2
N$22  (via drill 0.38)
  Top 0.254: R14.1 25.42,1.42 v26.01,2.01
  Bottom 0.254: v26.01,2.01 v26,2 RTK.2
N$23  (via drill 0.38)
  Top 0.254: R13.1 19.42,1.42 v20,2
  Bottom 0.254: v20,2 PPS.2
N$24
  Top 0.254: R13.2 17.46,2.58 D5.C
N$25
  Top 0.254: D6.C 23.46,2.58 R14.2
PPS  (via drill 0.38)
  Top 0.254: 15,27.33 U1.P53 | J3.5 11.49,27.33 15,27.33 | v15.12,27.21 15,27.33 | v15.18,13.65 15.18,2.06 D5.A
  Bottom 0.254: v15.12,27.21 15.18,27.15 v15.18,13.65
QWIIC_SCL
  Top 0.254: J2.5 13.45,46.3 8.07,40.92 J1.4 5,40.92 4.55,40.46 4.55,39.88 4.98,39.45 9.35,39.45 R4.1
QWIIC_SDA
  Top 0.254: J2.3 11,51.13 11,45.5 7.42,41.92 J1.3 4.92,41.92 4,41 4,39.7 4.7,39 11.24,39 R3.1
RF_IN
  Top 1: 29,22.94 J4.FEED
  pour Top (no thermals): 28.5,26.1 29.5,26.1 29.5,22.5 28.5,22.5
RTK_STAT  (via drill 0.38)
  Top 0.254: D6.A 21.12,2.89 22.24,4 26,4 28,2 45.85,2 v48,4.15 | U1.P20 46.27,31.73 v48,30
  Bottom 0.254: v48,4.15 v48,30
RXI2
  Top 0.254: J5.4 62.38,22.62 46.77,38.23 44.99,38.23 U1.P26
RXI/MOSI  (via drill 0.38)
  Top 0.254: U1.P43 24.15,38.33 21.31,41.17 v21.31,48.84
  Bottom 0.254: J2.19 28.84,48.82 21.46,48.82 21.44,48.84 v21.31,48.84 20.76,48.84 19.84,49.77 19.84,52.45 J2.10
SCL/CLK  (via drill 0.38)
  Top 0.254: U1.P45 24.09,36.13 19.56,40.66 v19.56,46.97
  Bottom 0.254: J2.23 36.31,49.97 33.34,47 19.59,47 v19.56,46.97
SDA/!CS  (via drill 0.38)
  Top 0.254: U1.P44 24.17,37.23 20.5,40.9 v20.5,47.62
  Bottom 0.254: J2.24 35,52.44 35,50.19 32.44,47.62 v20.5,47.62
SHIELD  (via drill 0.38)
  other vias: 61.9,34.62 61.82,40.23 64.03,34.62 63.98,40.13
  pour Top: 59.16,42.24 59.16,32.38 65.02,32.38 65.02,42.24
  pour Bottom: 65.02,42.01 65.02,32.38 59.16,32.38 59.16,42.01
TX_READY
  Top 0.254: U1.P46 23.68,35.03 20.34,31.7 7.78,31.7 7,32.47 J3.1
TXO2
  Top 0.254: U1.P27 45.22,39.2 46.52,39.2 60.56,25.16 J5.5
TXO/MISO  (via drill 0.38)
  Top 0.254: U1.P42 24.12,39.43 22.3,41.25 v22.3,48.26
  Bottom 0.254: J2.21 30.82,48.26 v22.3,48.26 19.03,48.26 17.27,50.02 17.27,52.48 J2.8
USB_D+
  Top 0.254: D4.3 J8.B6 59.8,38 60.07,37.73 60.07,37.24 59.83,37 J8.A6
USB_D-
  Top 0.254: J8.A7 58.04,37.5 | 58.04,37.5 D4.2 | J8.B7 58.4,36.5 58.04,36.86 58.04,37.5
V_BATT  (via drill 0.38)
  Top 0.254: v33.36,43.48 33.39,43.46 U1.P36 | v47,44.06 47.96,44.06 R1.1 52.86,46.57 B1.+
  Bottom 0.254: v33.36,43.48 46.48,43.48 47,44 v47,44.06
V_RF
  Top 0.508: U1.P7 34.49,23.58 R5.2

### Text on the board
tPlace: + | -
tDocu: Elias Santistevan